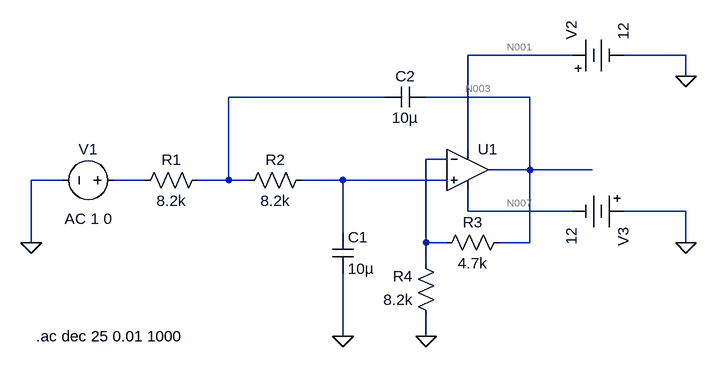
[diagram p0: schematic Sallen-Key_LowPass.asc]
Sallen-Key_LowPass.asc, the LTspice schematic file:
Version 4
SHEET 1 932 680
WIRE 640 -64 480 -64
WIRE 816 -64 720 -64
WIRE 816 -32 816 -64
WIRE 352 0 112 0
WIRE 576 0 416 0
WIRE 480 80 480 -64
WIRE 448 96 416 96
WIRE 576 112 576 0
WIRE 576 112 512 112
WIRE 672 112 576 112
WIRE -144 128 -192 128
WIRE -16 128 -64 128
WIRE 112 128 112 0
WIRE 112 128 64 128
WIRE 144 128 112 128
WIRE 288 128 224 128
WIRE 448 128 288 128
WIRE 480 176 480 144
WIRE 640 176 480 176
WIRE 816 176 720 176
WIRE 288 208 288 128
WIRE -192 224 -192 128
WIRE 416 224 416 96
WIRE 448 224 416 224
WIRE 576 224 576 112
WIRE 576 224 528 224
WIRE 816 224 816 176
WIRE 416 256 416 224
WIRE 288 368 288 272
WIRE 416 368 416 336
FLAG 288 368 0
FLAG 416 368 0
FLAG -192 224 0
FLAG 816 -32 0
FLAG 816 224 0
SYMBOL res 80 112 R90
WINDOW 0 0 56 VBottom 2
WINDOW 3 32 56 VTop 2
SYMATTR InstName R1
SYMATTR Value 8.2k
SYMBOL res 240 112 R90
WINDOW 0 0 56 VBottom 2
WINDOW 3 32 56 VTop 2
SYMATTR InstName R2
SYMATTR Value 8.2k
SYMBOL cap 272 208 R0
SYMATTR InstName C1
SYMATTR Value 10µ
SYMBOL cap 416 -16 R90
WINDOW 0 0 32 VBottom 2
WINDOW 3 32 32 VTop 2
SYMATTR InstName C2
SYMATTR Value 10µ
SYMBOL res 544 208 R90
WINDOW 0 0 56 VBottom 2
WINDOW 3 32 56 VTop 2
SYMATTR InstName R3
SYMATTR Value 4.7k
SYMBOL res 432 352 R180
WINDOW 0 36 76 Left 2
WINDOW 3 36 40 Left 2
SYMATTR InstName R4
SYMATTR Value 8.2k
SYMBOL voltage -48 128 R90
WINDOW 0 -32 56 VBottom 2
WINDOW 3 88 56 VTop 2
WINDOW 123 44 56 VTop 2
WINDOW 39 0 0 Left 0
SYMATTR InstName V1
SYMATTR Value ""
SYMATTR Value2 AC 1 0
SYMBOL OpAmps\\UniversalOpAmp2 480 112 R0
SYMATTR InstName U1
SYMBOL Misc\\battery 624 -64 R270
WINDOW 123 0 0 Left 0
WINDOW 39 0 0 Left 0
SYMATTR InstName V2
SYMATTR Value 12
SYMBOL Misc\\battery 736 176 R90
WINDOW 123 0 0 Left 0
WINDOW 39 0 0 Left 0
SYMATTR InstName V3
SYMATTR Value 12
TEXT -184 368 Left 2 !.ac dec 25 0.01 1000

The netlist it stands for:
* Sallen-Key_LowPass.asc
R1 N002 N005 8.2k
R2 N006 N002 8.2k
C1 N006 0 10µ
C2 N003 N002 10µ
R3 N003 N004 4.7k
R4 0 N004 8.2k
V1 N005 0 AC 1 0
XU1 N006 N004 N001 N007 N003 level2 Avol=1Meg GBW=10Meg Slew=10Meg Ilimit=25m Rail=0 Vos=0 En=0 Enk=0 In=0 Ink=0 Rin=500Meg  ; pins In+ In- V+ V- OUT
V2 N001 0 12
V3 0 N007 12
.ac dec 25 0.01 1000
.lib UniversalOpAmp2.lib
.backanno
.end

* Results of the author's LTspice run, read from the files saved beside the schematic
* Operating Point, zero values left out:
*   V(n001) = 12 V
*   V(n007) = -12 V
*   I(V3) = -1.199 mA
*   I(V2) = -1.199 mA
*   Ix(u1:3) = 1.199 mA
*   Ix(u1:4) = -1.199 mA
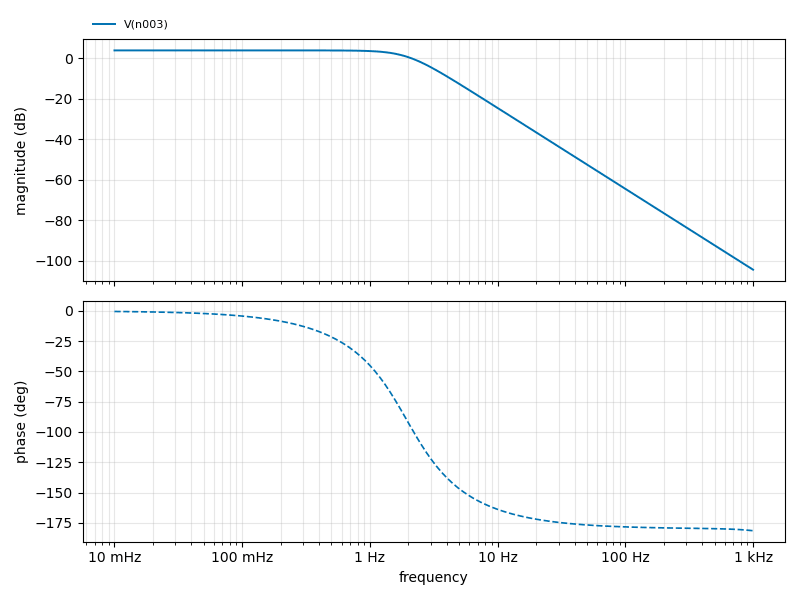
[diagram p1: AC Analysis of Sallen-Key_LowPass.asc, plotted from the saved traces]
* AC Analysis, 1 run:
*   V(n003): 3.94 dB at 10 mHz, -104.54 dB at 1 kHz, peak 3.94 dB at 10 mHz, 3 dB below the peak at 1.922 Hz